# Altium project VESC_POWER.PrjPcb
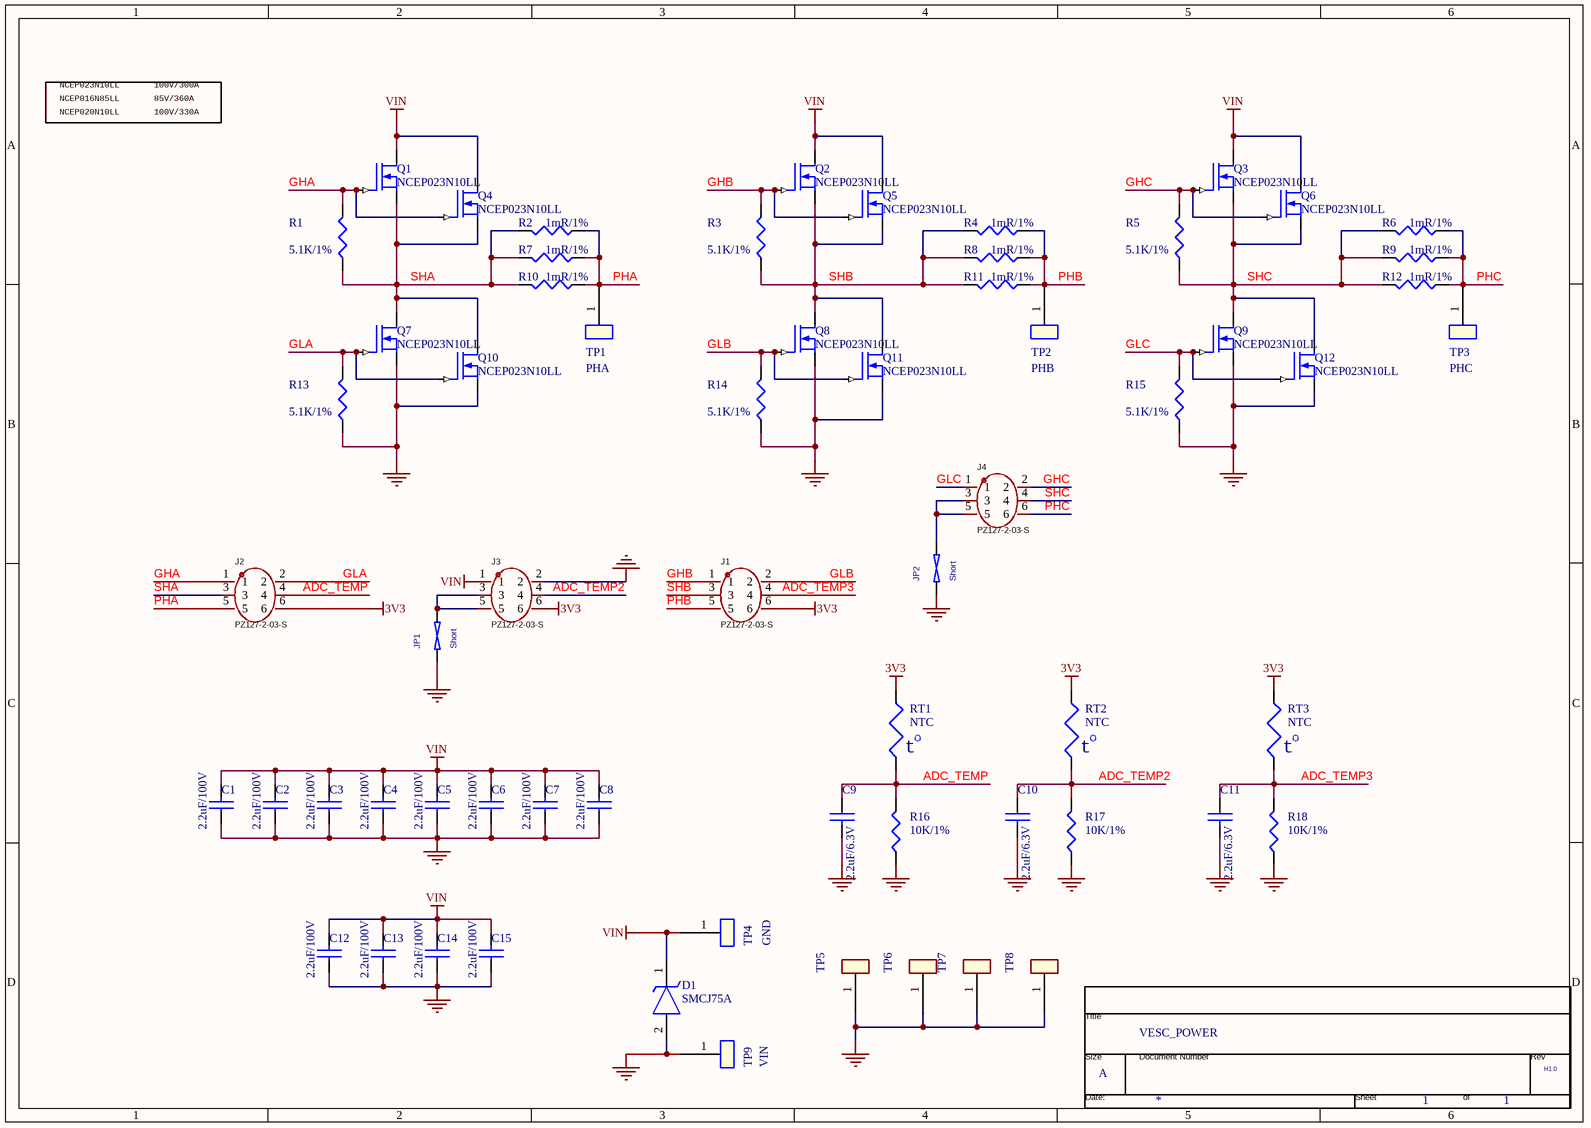
[diagram p0: VESC_POWER_SCH.SchDoc]
1 sheet, 65 parts. Net scope: global (net labels, ports and power ports of the same name join across sheets).
Board file: VESC_POWER_91mm.PcbDoc

## Sheet VESC_POWER_SCH.SchDoc
size 297 x 209 mm

### Parts
*  RevCode: H1.0  Title: VESC_POWER  Page Size: A  Page Number: 1  (hidden comment: TitleBlock0)  (graphical)
C1  2.2uF/100V  [CAPC3225X230N]
C2  2.2uF/100V  [CAPC3225X230N]
C3  2.2uF/100V  [CAPC3225X230N]
C4  2.2uF/100V  [CAPC3225X230N]
C5  2.2uF/100V  [CAPC3225X230N]
C6  2.2uF/100V  [CAPC3225X230N]
C7  2.2uF/100V  [CAPC3225X230N]
C8  2.2uF/100V  [CAPC3225X230N]
C9  2.2uF/6.3V  [C0603]
C10  2.2uF/6.3V  [C0603]
C11  2.2uF/6.3V  [C0603]
C12  2.2uF/100V  [CAPC3225X230N]
C13  2.2uF/100V  [CAPC3225X230N]
C14  2.2uF/100V  [CAPC3225X230N]
C15  2.2uF/100V  [CAPC3225X230N]
D1  SMCJ75A  [DIOM7959X262N]
J1  PZ127-2-03-S  [HDR-SMD_6P-P1.27-V-M-R2-C3-LS5.3]
J2  PZ127-2-03-S  [HDR-SMD_6P-P1.27-V-M-R2-C3-LS5.3]
J3  PZ127-2-03-S  [HDR-SMD_6P-P1.27-V-M-R2-C3-LS5.3]
J4  PZ127-2-03-S  [HDR-SMD_6P-P1.27-V-M-R2-C3-LS5.3]
JP1  Short  [SHORT]
JP2  Short  [SHORT]
Q1  NCEP023N10LL  [TOLL]
Q2  NCEP023N10LL  [TOLL]
Q3  NCEP023N10LL  [TOLL]
Q4  NCEP023N10LL  [TOLL]
Q5  NCEP023N10LL  [TOLL]
Q6  NCEP023N10LL  [TOLL]
Q7  NCEP023N10LL  [TOLL]
Q8  NCEP023N10LL  [TOLL]
Q9  NCEP023N10LL  [TOLL]
Q10  NCEP023N10LL  [TOLL]
Q11  NCEP023N10LL  [TOLL]
Q12  NCEP023N10LL  [TOLL]
R1  5.1K/1%  [R0603]
R2  1mR/1%  [R2512]
R3  5.1K/1%  [R0603]
R4  1mR/1%  [R2512]
R5  5.1K/1%  [R0603]
R6  1mR/1%  [R2512]
R7  1mR/1%  [R2512]
R8  1mR/1%  [R2512]
R9  1mR/1%  [R2512]
R10  1mR/1%  [R2512]
R11  1mR/1%  [R2512]
R12  1mR/1%  [R2512]
R13  5.1K/1%  [R0603]
R14  5.1K/1%  [R0603]
R15  5.1K/1%  [R0603]
R16  10K/1%  [R0603]
R17  10K/1%  [R0603]
R18  10K/1%  [R0603]
RT1  NTC  [R0603]
RT2  NTC  [R0603]
RT3  NTC  [R0603]
TP1  PHA  [TP_8x8]
TP2  PHB  [TP_8x8]
TP3  PHC  [TP_8x8]
TP4  GND  [TP_8x8]
TP5  TEST POINT  [HOLE-3.2MM_M]  (value not drawn)
TP6  TEST POINT  [HOLE-3.2MM_M]  (value not drawn)
TP7  TEST POINT  [HOLE-3.2MM_M]  (value not drawn)
TP8  TEST POINT  [HOLE-3.2MM_M]  (value not drawn)
TP9  VIN  [TP_8x8]

### Nets
3V3: J1.6 J2.6 J3.6 RT1.1 RT2.1 RT3.1
GND: C1.1 C2.1 C3.1 C4.1 C5.1 C6.1 C7.1 C8.1 C9.2 C10.2 C11.2 C12.1 C13.1 C14.1 C15.1 D1.2(A) J3.2 JP1.1 JP2.1 Q7.3(SOURCE) Q8.3(SOURCE) Q9.3(SOURCE) Q10.3(SOURCE) Q11.3(SOURCE) Q12.3(SOURCE) R13.1 R14.1 R15.1 R16.1 R17.1 R18.1 TP5.1 TP6.1 TP7.1 TP8.1 TP9.1
VIN: C1.2 C2.2 C3.2 C4.2 C5.2 C6.2 C7.2 C8.2 C12.2 C13.2 C14.2 C15.2 D1.1(K) J3.1 Q1.2(DRAIN) Q2.2(DRAIN) Q3.2(DRAIN) Q4.2(DRAIN) Q5.2(DRAIN) Q6.2(DRAIN) TP4.1
ADC_TEMP: C9.1 J2.4 R16.2 RT1.2
ADC_TEMP2: C10.1 J3.4 R17.2 RT2.2
ADC_TEMP3: C11.1 J1.4 R18.2 RT3.2
GHA: J2.1 Q1.1(GATE) Q4.1(GATE) R1.2
GHB: J1.1 Q2.1(GATE) Q5.1(GATE) R3.2
GHC: J4.2 Q3.1(GATE) Q6.1(GATE) R5.2
GLA: J2.2 Q7.1(GATE) Q10.1(GATE) R13.2
GLB: J1.2 Q8.1(GATE) Q11.1(GATE) R14.2
GLC: J4.1 Q9.1(GATE) Q12.1(GATE) R15.2
PHA: J2.5 R2.1 R7.1 R10.1 TP1.1
PHB: J1.5 R4.1 R8.1 R11.1 TP2.1
PHC: J4.6 R6.1 R9.1 R12.1 TP3.1
SHA: J2.3 Q1.3(SOURCE) Q4.3(SOURCE) Q7.2(DRAIN) Q10.2(DRAIN) R1.1 R2.2 R7.2 R10.2
SHB: J1.3 Q2.3(SOURCE) Q5.3(SOURCE) Q8.2(DRAIN) Q11.2(DRAIN) R3.1 R4.2 R8.2 R11.2
SHC: J4.4 Q3.3(SOURCE) Q6.3(SOURCE) Q9.2(DRAIN) Q12.2(DRAIN) R5.1 R6.2 R9.2 R12.2
NetJ3_3: J3.3 J3.5 JP1.2
NetJ4_3: J4.3 J4.5 JP2.2

### Notes on the sheet
- NCEP023N10LL
- NCEP020N10LL
- NCEP016N85LL
- 85V/360A
- 100V/330A
- 100V/300A
- (in symbol NTC) t
- (in symbol TitleBlock0) Title; Size; Document Number; Rev; Date:; Sheet; of

### Library data of the parts
C1-C8 C12-C15 = CAP NP: PCB Footprint: C1206
C9-C11 = CAP NP: PCB Footprint: C0603
D1 = SMCJ75A: TVS Diode (Uni-directional); Manufacturer_Name: Bourns; Datasheet Link: https://www.bourns.com/docs/Product-Datasheets/SMCJ.pdf; Height: 2.62mm; Manufacturer_Part_Number: SMCJ75A; Mouser Part Number: 652-SMCJ75A; Mouser Price/Stock: https://www.mouser.co.uk/ProductDetail/Bourns/SMCJ75A?qs=%252Bf8Cd6aE5bzxrdYbQ%252Bf9mA%3D%3D; Arrow Part Number: SMCJ75A; Arrow Price/Stock: https://www.arrow.com/en/products/smcj75a/bourns?region=nac
J1-J4 = PZ127-2-03-S: Manufacturer: HCTL(华灿天禄); Add into BOM: yes; Pin Structure: 2x3P; Pitch: 1.27mm; Circluar Pins/Square Pins: 方针; Current Rating (Max): 1A; Soldering Temperature(Max): 260℃@10S; Symbol: PZ127-2-03-S; Device: PZ127-2-03-S; LCSC Part Name: 2x3P 间距:1.27mm 方针 立贴; Supplier Part: C3975186; Manufacturer Part: PZ127-2-03-S; Supplier Footprint: SMD,P=1.27mm; JLCPCB Part Class: Extended Part; Datasheet: https://atta.szlcsc.com/upload/public/pdf/source/20230609/2ACB07ADC7D4DAF6D292F3D23C037F6C.pdf; Supplier: LCSC; Convert to PCB: yes; Row Spacing: 1.27mm; Mounting Type: 立贴; Number of Rows: 双排; Number of Pins: 6P; Length of Mating Pin: 4mm; Insulation Height: 1.5mm; Length of End Connection Pin: -; Contact Material: 黄铜; Operating Temperature Range: -40℃~+105℃; Color: 黑色
JP1 JP2 = SHORT: 2 PIN SHORTED TO CONNECT DIFFERENT NETS; PART_NUMBER: TMP-442; CLASS: DISCRETE
Q1-Q12 = MOSFET N: PCB Footprint: TOLL
R1 R3 R5 R13-R18 = RESISTOR: PCB Footprint: R0603
R2 R4 R6-R12 = RESISTOR: PCB Footprint: R3920
TP1-TP4 TP9 = TEST POINT: PCB Footprint: TP_8x8
* = TitleBlock0: Page Create Date: March  8, 1995; Page Count: 1; Page Modify Date: *
RT1-RT3 = NTC: PCB Footprint: R0603